# EasyEDA schematic SCH_Sesame-Distro-Board-V2_2026-03-06.json
TITLE: Sesame Seed Board (DistroV2); REV: 2; Date: 2026-01-18; Sheet: 1/1; Drawn By: Dorian Todd; Company: Dorian T Engineering
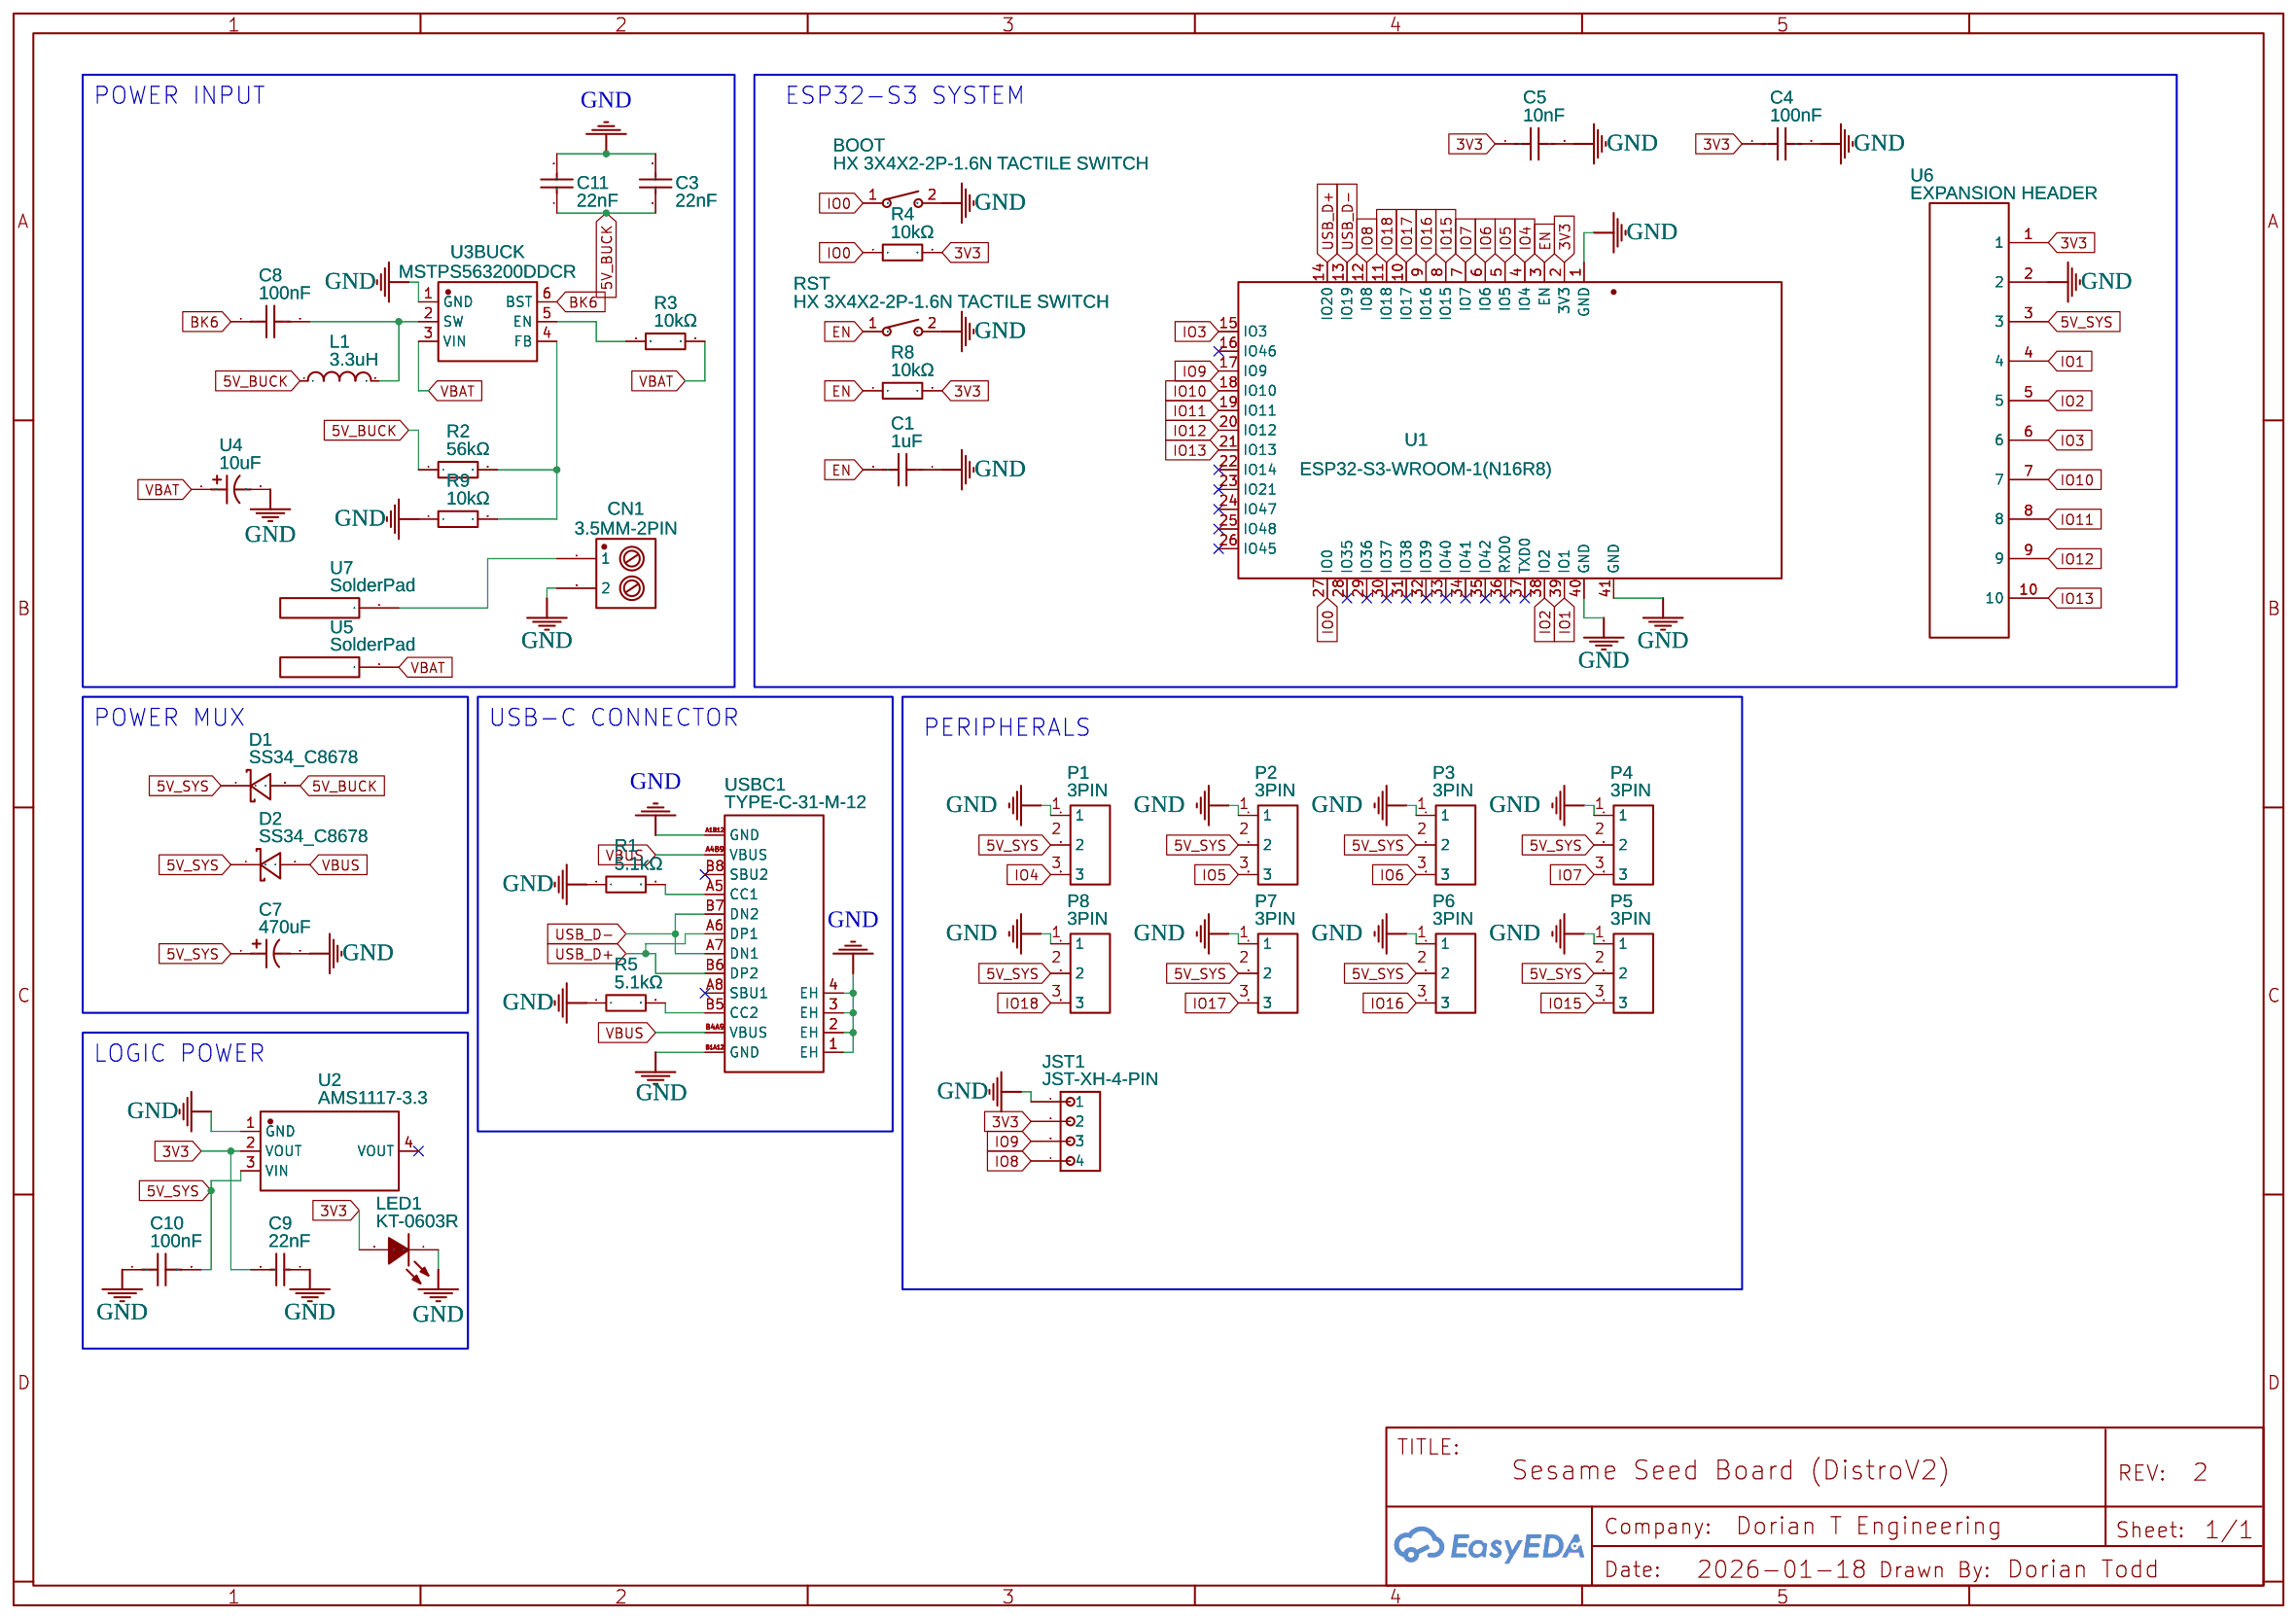
[diagram p0: schematic sheet]

## Parts
BOOT  HX 3X4X2-2P-1.6N TACTILE SWITCH  [KEY-SMD_L4.0-W3.0-LS4.9-1]
C1  1uF  [C0805]
C3  22nF  [C0603]
C4  100nF  [C0603]
C5  10nF  [C0603]
C7  470uF  [CAP-SMD_BD10.0-L10.3-W10.3-LS11.3-FD]
C8  100nF  [C0603]
C9  22nF  [C0603]
C10  100nF  [C0603]
C11  22nF  [C0603]
CN1  3.5MM-2PIN  [SCREWTERM-3.5MM-2PIN]
D1  SS34_C8678  [SMA_L4.3-W2.6-LS5.2-RD]
D2  SS34_C8678  [SMA_L4.3-W2.6-LS5.2-RD]
JST1  JST-XH-4-PIN  [JST-XH-4PIN-2.5]
L1  3.3uH  [IND-SMD_L7.3-W6.6]
LED1  KT-0603R  [LED0603-RD]
P1  3PIN  [CONNECTOR_PINHEADER_2.54MM:PINHEADER_1X3]
P2  3PIN  [CONNECTOR_PINHEADER_2.54MM:PINHEADER_1X3]
P3  3PIN  [CONNECTOR_PINHEADER_2.54MM:PINHEADER_1X3]
P4  3PIN  [CONNECTOR_PINHEADER_2.54MM:PINHEADER_1X3]
P5  3PIN  [CONNECTOR_PINHEADER_2.54MM:PINHEADER_1X3]
P6  3PIN  [CONNECTOR_PINHEADER_2.54MM:PINHEADER_1X3]
P7  3PIN  [CONNECTOR_PINHEADER_2.54MM:PINHEADER_1X3]
P8  3PIN  [CONNECTOR_PINHEADER_2.54MM:PINHEADER_1X3]
R1  5.1kΩ  [R0603]
R2  56kΩ  [R0603]
R3  10kΩ  [R0603]
R4  10kΩ  [R0603]
R5  5.1kΩ  [R0603]
R8  10kΩ  [R0603]
R9  10kΩ  [R0603]
RST  HX 3X4X2-2P-1.6N TACTILE SWITCH  [KEY-SMD_L4.0-W3.0-LS4.9-1]
U1  ESP32-S3-WROOM-1(N16R8)  [WIRELM-SMD_ESP32-S3-WROOM-1]
U2  AMS1117-3.3  [SOT-223-3_L6.5-W3.4-P2.30-LS7.0-BR]
U3BUCK  MSTPS563200DDCR  [SOT-23-6_L2.9-W1.6-P0.95-LS2.8-BR]
U4  10uF  [CAP-SMD_BD4.0-L4.3-W4.3-LS5.0-FD]
U5  SolderPad  [SOLDERPAD LG]
U6  EXPANSION HEADER  [HEADER MALE 2.54-1*10]
U7  SolderPad  [SOLDERPAD LG]
USBC1  TYPE-C-31-M-12  [USB-C_SMD-TYPE-C-31-M-12_1]

## Library data of the parts
BOOT RST = HX 3X4X2-2P-1.6N TACTILE SWITCH: Supplier: LCSC; Supplier Part: C49234124; Manufacturer: hanxia(韩下); Manufacturer Part: HX 3x4x2-2P-1.6N TACTILE SWITCH; JLCPCB Part Class: Extended Part; Contributor: lcsc
C1 = AC0805KKX7R9BB105: Supplier: LCSC; Supplier Part: C726584; Manufacturer: YAGEO(国巨); JLCPCB Part Class: Extended Part; Contributor: lcsc
C3 C9 C11 = CL10B223KB8NNNC: Supplier: LCSC; Manufacturer: SAMSUNG(三星); Supplier Part: C21122; JLCPCB Part Class: Basic Part
C4 C8 C10 = CC0603KRX7R9BB104: Supplier: LCSC; Manufacturer: YAGEO(国巨); Supplier Part: C14663; JLCPCB Part Class: Basic Part
C5 = C0603B103M500NT: Supplier: LCSC; Supplier Part: C17702744; Manufacturer: TORCH(火炬); Contributor: lcsc; JLCPCB Part Class: Extended Part
C7 = XT470UF25V90RV0111: Contributor: lcsc; Supplier: LCSC; Supplier Part: C3445244; Manufacturer: KNSCHA(科尼盛); JLCPCB Part Class: Extended Part
CN1 = SCREWTERM-RA-3.5MM-2PIN: Supplier: Digi-Key; Manufacturer: Phoenix Contact; Manufacturer Part: 1984617; Contributor: niels; LCSC Assembly: Yes; SMT Type: Extend
D1 D2 = SS34_C8678: Supplier: LCSC; Manufacturer Part: SS34; Manufacturer: MDD(辰达半导体); Supplier Part: C8678; JLCPCB Part Class: Basic Part
JST1 = JST-XH-4-PIN: Contributor: michalsky
L1 = MHCI06030-3R3M-S8: Contributor: LCSC; Supplier: LCSC; Supplier Part: C285713; Manufacturer: Chilisin(奇力新); JLCPCB Part Class: Extended Part
LED1 = KT-0603R: Supplier: LCSC; Manufacturer: KENTO; Supplier Part: C2286; JLCPCB Part Class: Basic Part
P1-P8 = HEADER PAD 3 PIN: Supplier: LCSC; Manufacturer: BOOMELE; Manufacturer Part: Female headerHDR1X8-2.54; Supplier Part: C27438; JLCPCB Part Class: Extended Part; Contributor: juchani
R1 R5 = 0603WAF5101T5E: Supplier: LCSC; Manufacturer: UNI-ROYAL(厚声); Supplier Part: C23186; JLCPCB Part Class: Basic Part
R2 = 0603WAF5602T5E: Supplier: LCSC; Manufacturer: UNI-ROYAL(厚声); Supplier Part: C23206; JLCPCB Part Class: Basic Part
R3 R4 R8 R9 = RCT0310KJLF: Contributor: LCSC; Supplier: LCSC; Supplier Part: C177337; Manufacturer: HKR(香港电阻); JLCPCB Part Class: Extended Part
U1 = ESP32-S3-WROOM-1(N16R8): Contributor: lcsc; Supplier: LCSC; Supplier Part: C2913202; Manufacturer: ESPRESSIF(乐鑫); Manufacturer Part: ESP32-S3-WROOM-1-N16R8; JLCPCB Part Class: Extended Part
U2 = AMS1117-3.3: sourceId: dwIGgezVh; Supplier: LCSC; Manufacturer: AMS; Supplier Part: C6186; JLCPCB Part Class: Basic Part
U3BUCK = MSTPS563200DDCR: Supplier: LCSC; Supplier Part: C49208508; Manufacturer: MSKSEMI(美森科); Contributor: lcsc; JLCPCB Part Class: Extended Part
U4 = RST10UF25V014: Supplier: LCSC; Supplier Part: C4747969; Manufacturer: KNSCHA(科尼盛); JLCPCB Part Class: Extended Part; Contributor: lcsc
U5 U7 = SolderPad: Contributor: jm4023
U6 = HEADER MALE 2.54-1*10: Contributor: shivampatel
USBC1 = TYPE-C-31-M-12: Contributor: LCSC; Supplier: LCSC; Supplier Part: C165948; Manufacturer: 韩国韩荣; JLCPCB Part Class: Extended Part

## Nets
3V3: C4.1 C5.1 C9.2 JST1.2 LED1.2(A) R4.2 R8.2 U1.2(3V3) U2.2(VOUT) U6.1
5V_BUCK: C3.1 C11.1 D1.2(A) L1.1 R2.1
5V_SYS: C7.1 C10.2 D1.1(K) D2.1(K) P1.2 P2.2 P3.2 P4.2 P5.2 P6.2 P7.2 P8.2 U2.3(VIN) U6.3
GND: BOOT.2 C1.1 C3.2 C4.2 C5.2 C7.2 C9.1 C10.1 C11.2 CN1.2 JST1.1 LED1.1(K) P1.1 P2.1 P3.1 P4.1 P5.1 P6.1 P7.1 P8.1 R1.1 R5.1 R9.1 RST.2 U1.1(GND) U1.40(GND) U1.41(GND) U2.1(GND) U3BUCK.1(GND) U4.2 U6.2 USBC1.1(EH) USBC1.2(EH) USBC1.3(EH) USBC1.4(EH) USBC1.A1B12(GND) USBC1.B1A12(GND)
VBAT: R3.2 U3BUCK.3(VIN) U4.1 U5.1
VBUS: D2.2(A) USBC1.A4B9(VBUS) USBC1.B4A9(VBUS)
BK6: C8.1 U3BUCK.6(BST)
EN: C1.2 R8.1 RST.1 U1.3(EN)
IO0: BOOT.1 R4.1 U1.27(IO0)
IO1: U1.39(IO1) U6.4
IO2: U1.38(IO2) U6.5
IO3: U1.15(IO3) U6.6
IO4: P1.3 U1.4(IO4)
IO5: P2.3 U1.5(IO5)
IO6: P3.3 U1.6(IO6)
IO7: P4.3 U1.7(IO7)
IO8: JST1.4 U1.12(IO8)
IO9: JST1.3 U1.17(IO9)
IO10: U1.18(IO10) U6.7
IO11: U1.19(IO11) U6.8
IO12: U1.20(IO12) U6.9
IO13: U1.21(IO13) U6.10
IO15: P5.3 U1.8(IO15)
IO16: P6.3 U1.9(IO16)
IO17: P7.3 U1.10(IO17)
IO18: P8.3 U1.11(IO18)
USB_D+: U1.14(IO20) USBC1.A6(DP1) USBC1.B6(DP2)
USB_D-: U1.13(IO19) USBC1.A7(DN1) USBC1.B7(DN2)
Net-(C8-2): C8.2 L1.2 U3BUCK.2(SW)
Net-(CN1-1): CN1.1 U7.1
Net-(R1-2): R1.2 USBC1.A5(CC1)
Net-(R2-2): R2.2 R9.2 U3BUCK.4(FB)
Net-(R3-1): R3.1 U3BUCK.5(EN)
Net-(R5-2): R5.2 USBC1.B5(CC2)

Not connected (* = marked no-connect by the designer): U1 16(IO46)* 22(IO14)* 23(IO21)* 24(IO47)* 25(IO48)* 26(IO45)* 28(IO35)* 29(IO36)* 30(IO37)* 31(IO38)* 32(IO39)* 33(IO40)* 34(IO41)* 35(IO42)* 36(RXD0)* 37(TXD0)*; U2 4(VOUT)*; USBC1 A8(SBU1)* B8(SBU2)*

## Notes on the sheet
- POWER INPUT
- ESP32-S3 SYSTEM
- POWER MUX
- USB-C CONNECTOR
- PERIPHERALS
- LOGIC POWER
